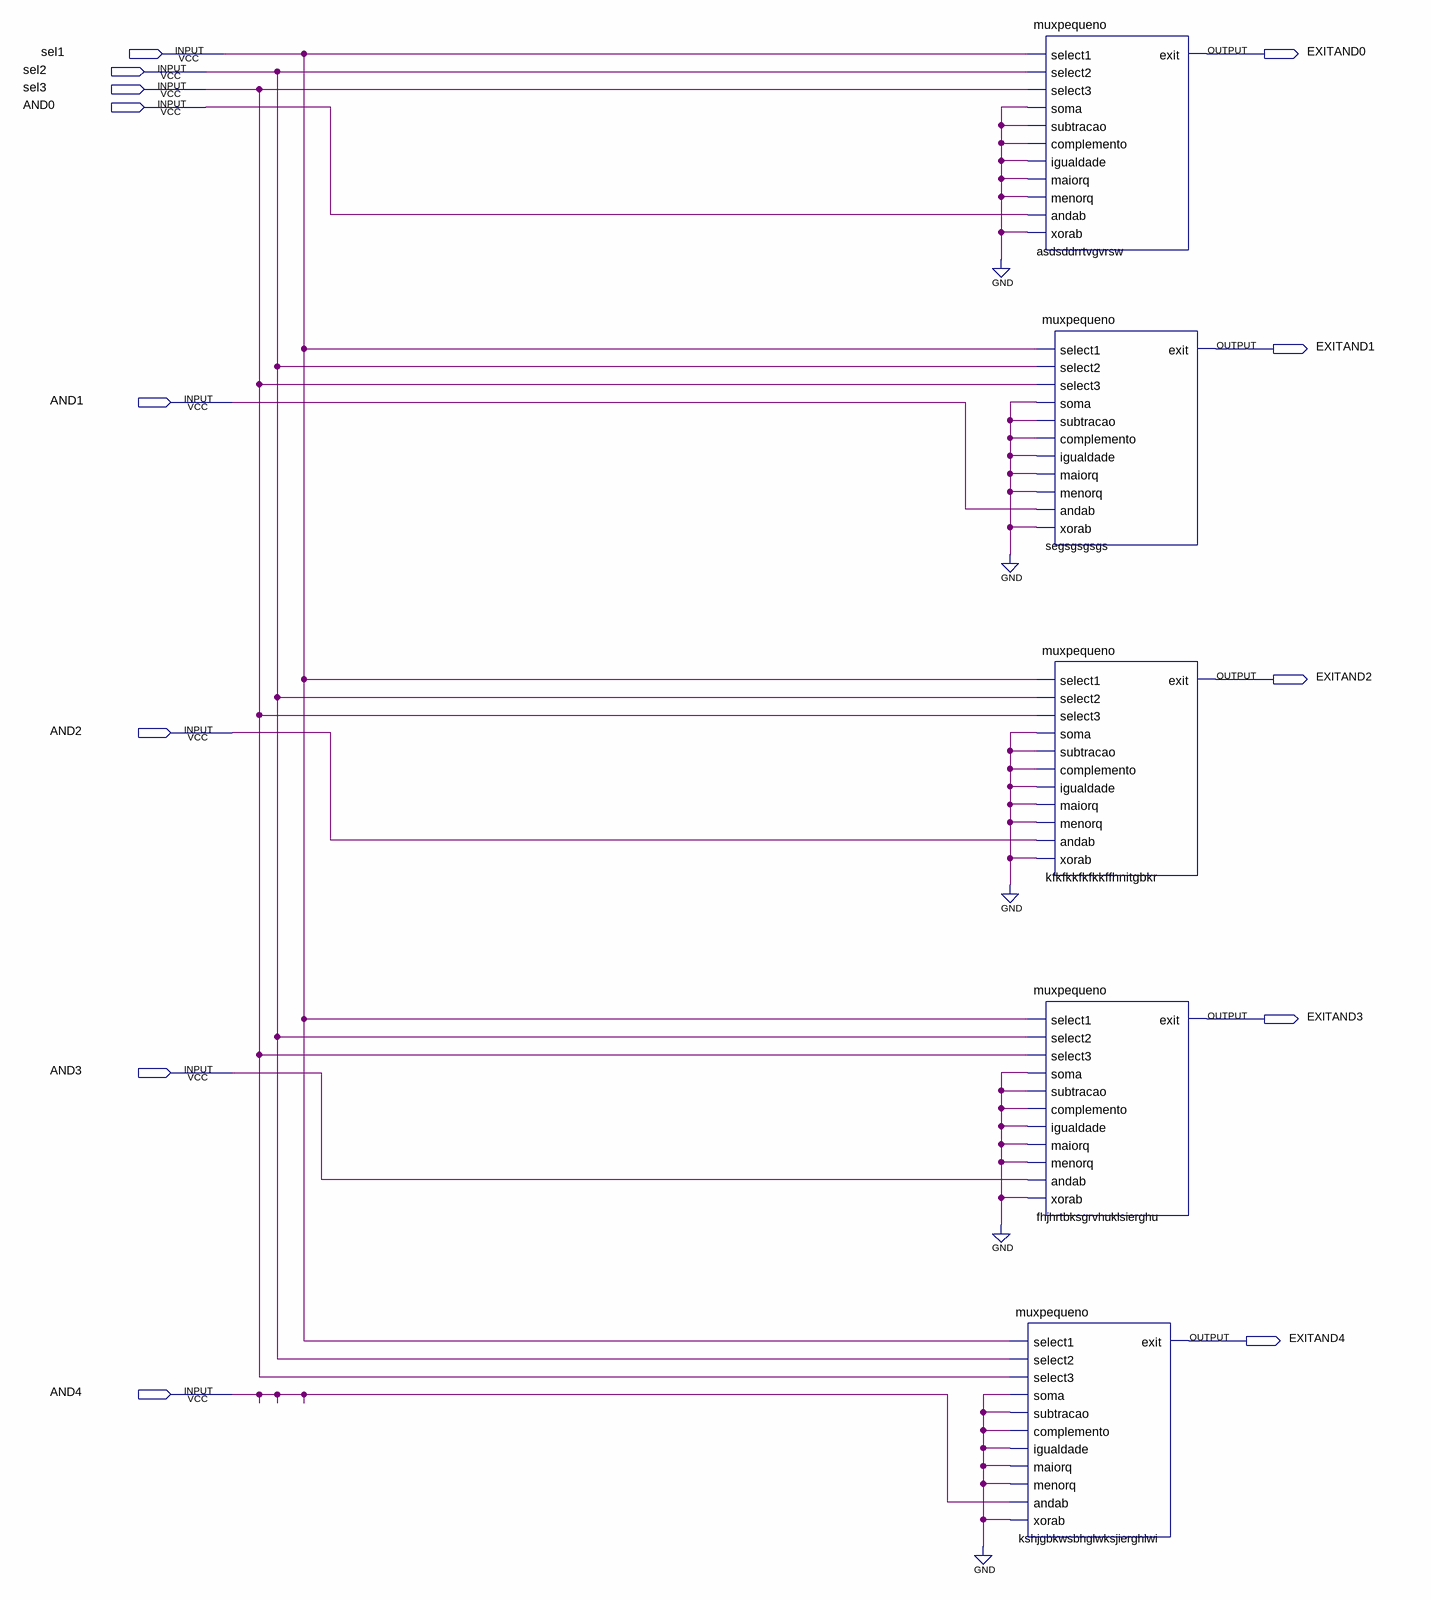
[diagram p0: schematic sheet]
// Quartus schematic MUXAND.bdf as structural Verilog: 5 symbols, 13 pins
module MUXAND (
  input  sel1,
  input  sel2,
  input  sel3,
  input  AND0,
  input  AND1,
  input  AND2,
  input  AND3,
  input  AND4,
  output EXITAND0,
  output EXITAND1,
  output EXITAND2,
  output EXITAND3,
  output EXITAND4
);

  muxpequeno asdsddrrtvgvrsw (
    .select1(sel1), .select2(sel2), .select3(sel3), .soma(1'b0), .subtracao(1'b0), .complemento(1'b0),
    .igualdade(1'b0), .maiorq(1'b0), .menorq(1'b0), .andab(AND0), .xorab(1'b0), .exit(EXITAND0));
  muxpequeno segsgsgsgs (
    .select1(sel1), .select2(sel2), .select3(sel3), .soma(1'b0), .subtracao(1'b0), .complemento(1'b0),
    .igualdade(1'b0), .maiorq(1'b0), .menorq(1'b0), .andab(AND1), .xorab(1'b0), .exit(EXITAND1));
  muxpequeno kfkfkkfkfkkffhnitgbkr (
    .select1(sel1), .select2(sel2), .select3(sel3), .soma(1'b0), .subtracao(1'b0), .complemento(1'b0),
    .igualdade(1'b0), .maiorq(1'b0), .menorq(1'b0), .andab(AND2), .xorab(1'b0), .exit(EXITAND2));
  muxpequeno fhjhrtbksgrvhuklsierghu (
    .select1(sel1), .select2(sel2), .select3(sel3), .soma(1'b0), .subtracao(1'b0), .complemento(1'b0),
    .igualdade(1'b0), .maiorq(1'b0), .menorq(1'b0), .andab(AND3), .xorab(1'b0), .exit(EXITAND3));
  muxpequeno kshjgbkwsbhglwksjierghlwi (
    .select1(sel1), .select2(sel2), .select3(sel3), .soma(1'b0), .subtracao(1'b0), .complemento(1'b0),
    .igualdade(1'b0), .maiorq(1'b0), .menorq(1'b0), .andab(AND4), .xorab(1'b0), .exit(EXITAND4));
endmodule
